# EAGLE design KGBuffer (EAGLE 9.3.1)
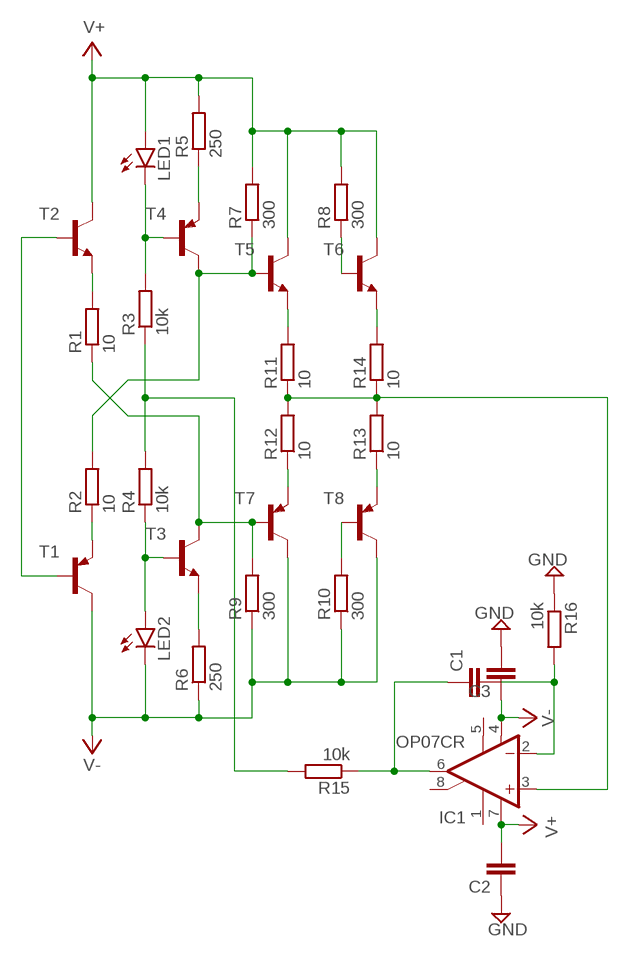
[diagram p0: schematic, sheet 1]

## Parts
C1  C-EUC0603K  [C0603K]
C2  C-EUC0805K  [C0805K]
C3  C-EUC0805K  [C0805K]
IC1  OP07CR  [SO08]
LED1  LEDSMT1206  [1206]
LED2  LEDSMT1206  [1206]
R1  10  R-EU_MELF0204W  [MINI_MELF-0204W]
R2  10  R-EU_MELF0204W  [MINI_MELF-0204W]
R3  10k  R-EU_MELF0204W  [MINI_MELF-0204W]
R4  10k  R-EU_MELF0204W  [MINI_MELF-0204W]
R5  250  R-EU_MELF0204W  [MINI_MELF-0204W]
R6  250  R-EU_MELF0204W  [MINI_MELF-0204W]
R7  300  R-EU_MELF0204W  [MINI_MELF-0204W]
R8  300  R-EU_MELF0204W  [MINI_MELF-0204W]
R9  300  R-EU_MELF0204W  [MINI_MELF-0204W]
R10  300  R-EU_MELF0204W  [MINI_MELF-0204W]
R11  10  R-EU_MELF0204W  [MINI_MELF-0204W]
R12  10  R-EU_MELF0204W  [MINI_MELF-0204W]
R13  10  R-EU_MELF0204W  [MINI_MELF-0204W]
R14  10  R-EU_MELF0204W  [MINI_MELF-0204W]
R15  10k  R-EU_MELF0204W  [MINI_MELF-0204W]
R16  10k  R-EU_MELF0204W  [MINI_MELF-0204W]
T1  BC856BLT1-PNP-SOT23-BEC  [SOT23-BEC]
T2  BC846-NPN-SOT23-BEC  [SOT23-BEC]
T3  BC846-NPN-SOT23-BEC  [SOT23-BEC]
T4  BC856BLT1-PNP-SOT23-BEC  [SOT23-BEC]
T5  BC846-NPN-SOT23-BEC  [SOT23-BEC]
T6  BC846-NPN-SOT23-BEC  [SOT23-BEC]
T7  BC856BLT1-PNP-SOT23-BEC  [SOT23-BEC]
T8  BC856BLT1-PNP-SOT23-BEC  [SOT23-BEC]

## Nets
GND: C2.1 C3.2 R16.1
N$1: T1.B T2.B
N$2: R2.1 T1.E
N$3: R1.2 T2.E
N$5: C1.1 IC1.6(OUT) R15.1
N$6: LED1.C R3.2 T4.B
N$7: R5.1 T4.E
N$8: R2.2 R7.1 T4.C T5.B
N$9: R6.2 T3.E
N$10: LED2.A R4.1 T3.B
N$11: R1.1 R9.2 T3.C T7.B
N$12: R3.1 R4.2 R15.2
N$15: R10.2 T8.B
N$16: C1.2 IC1.2(-IN) R16.2
N$20: R8.1 T6.B
N$21: R11.2 T5.E
N$23: R12.1 T7.E
N$24: R13.1 T8.E
N$26: R14.2 T6.E
N$27: IC1.3(+IN) R11.1 R12.2 R13.2 R14.1
V+: C2.2 IC1.7(V+) LED1.A R5.2 R7.2 R8.2 T2.C T5.C T6.C
V-: C3.1 IC1.4(V-) LED2.C R6.1 R9.1 R10.1 T1.C T7.C T8.C
Unconnected: IC1.1(ON1) IC1.5(OPT) IC1.8(ON2)

## Library data of the parts
C1-C3 = Vwvwbg:C-EU: CAPACITOR, European symbol
IC1 = linear:OP07*: OP AMP
LED1 LED2 = Vwvwbg:LED: LED OSRAM: - CHIPLED LG R971, LG N971, LY N971, LG Q971, LY Q971, LO R971, LY R971 LH N974, LH R974 LS Q976, LO Q976, LY Q976 LO Q996 - Hyper CHIPLED LW Q18S LB Q993, LB Q99A, LB R99A - SideLED LS A670, LO A670, LY A670, LG A670, LP A670 LB A673, LV A673, LT A673, LW A673 LH A674 LY A675 LS A676, LA A676, LO A676, LY A676, LW A676 LS A679, LY A679, LG A679 - Hyper Micro SIDELED® LS Y876, LA Y876, LO Y876, LY Y876 LT Y87S - SmartLED LW L88C, LW L88S LB L89C, LB L89S, LG L890 LS L89K, LO L89K, LY L89K LS L896, LA L896, LO L896, LY L896 - TOPLED LS T670, LO T670, LY T670, LG T670, LP T670 LSG T670, LSP T670, LSY T670, LOP T670, LYG T670 LG T671, LOG T671, LSG T671 LB T673, LV T673, LT T673, LW T673 LH T674 LS T676, LA T676, LO T676, LY T676, LB T676, LH T676, LSB T676, LW T676 LB T67C, LV T67C, LT T67C, LS T67K, LO T67K, LY T67K, LW E67C LS E67B, LA E67B, LO E67B, LY E67B, LB E67C, LV E67C, LT E67C LW T67C LS T679, LY T679, LG T679 LS T770, LO T770, LY T770, LG T770, LP T770 LB T773, LV T773, LT T773, LW T773 LH T774 LS E675, LA E675, LY E675, LS T675 LS T776, LA T776, LO T776, LY T776, LB T776 LHGB T686 LT T68C, LB T68C - Hyper Mini TOPLED® LB M676 - Mini TOPLED Santana® LG M470 LS M47K, LO M47K, LY M47K Source: http://www.osram.convergy.de LUXEON: - LUMILED® LXK2-PW12-R00, LXK2-PW12-S00, LXK2-PW14-U00, LXK2-PW14-V00 LXK2-PM12-R00, LXK2-PM12-S00, LXK2-PM14-U00 LXK2-PE12-Q00, LXK2-PE12-R00, LXK2-PE12-S00, LXK2-PE14-T00, LXK2-PE14-U00 LXK2-PB12-K00, LXK2-PB12-L00, LXK2-PB12-M00, LXK2-PB14-N00, LXK2-PB14-P00, LXK2-PB14-Q00 LXK2-PR12-L00, LXK2-PR12-M00, LXK2-PR14-Q00, LXK2-PR14-R00 LXK2-PD12-Q00, LXK2-PD12-R00, LXK2-PD12-S00 LXK2-PH12-R00, LXK2-PH12-S00 LXK2-PL12-P00, LXK2-PL12-Q00, LXK2-PL12-R00 Source: www.luxeon.com KINGBRIGHT: KA-3528ASYC Source: www.kingbright.com
R1-R16 = Vwvwbg:R-EU_: RESISTOR, European symbol
T1 T4 T7 T8 = transistor-neu-to92:*-PNP-: PNP Transistror
T2 T3 T5 T6 = transistor-neu-to92:*-NPN-: NPN Transistror

## Board
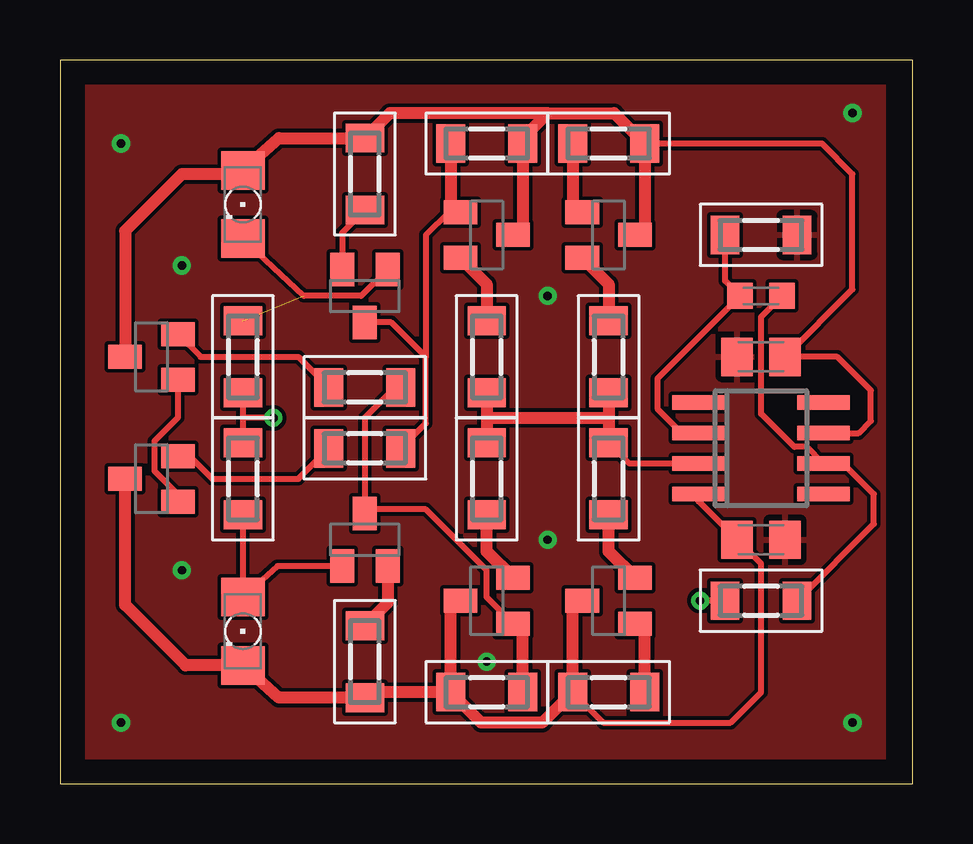
[diagram p1: board, top side]
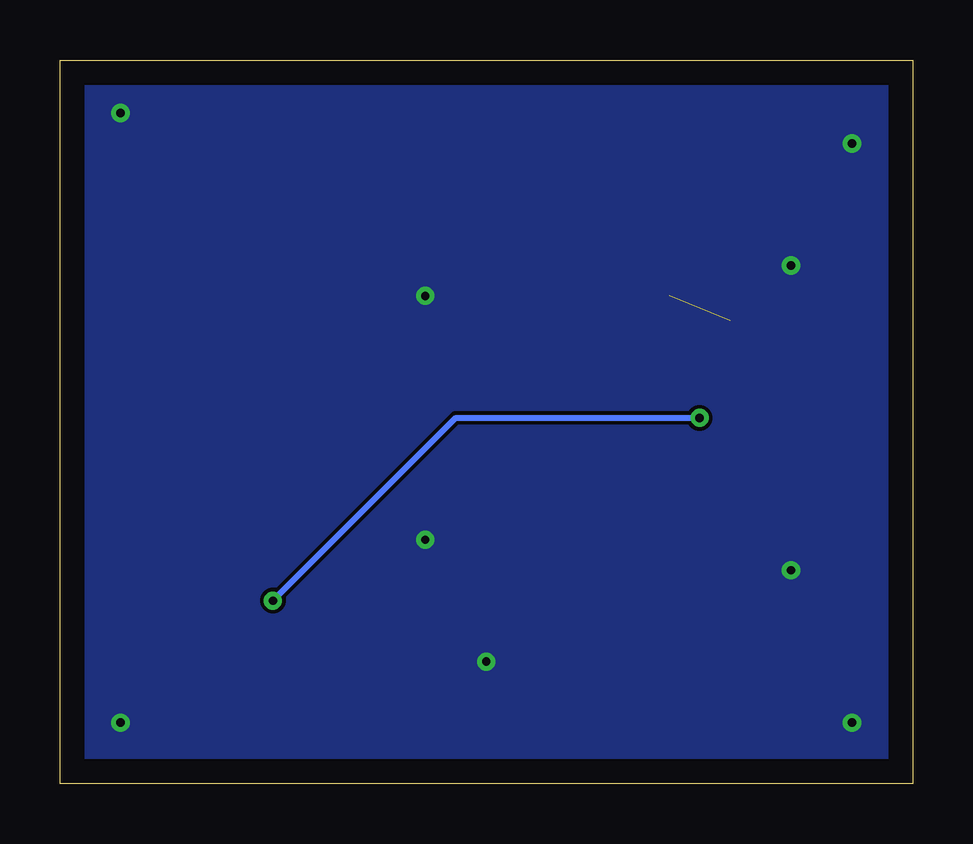
[diagram p2: board, bottom side, seen from below]

Size 35.54 x 30.15 mm. Coordinates in mm from the lower left corner, seen from the top.
Outline: 0,0 35.54,0 35.54,30.15 0,30.15 0,0
Copper layers (1*16): Top 0.035mm / dielectric 1.5mm / Bottom 0.035mm
Design rules "default": minimum track width 6mil, minimum drill 0.35mm, track to track 6mil, track to pad 6mil, pad to pad 6mil, via to via 6mil, smd to smd 6mil, copper to edge 40mil, drill to drill 6mil, minimum pad ring 10mil, minimum via ring 8mil, stop-mask expansion 4mil, vias tented up to drill 0mil, thermal gap 10mil

### Footprints (pad centres in the part's own frame; a part is rotated, then mirrored left to right if it is on the bottom)
C0603K = smd 1.05 x 1.08: 1 -0.875,0; 2 0.875,0
C0805K = smd 1.3 x 1.6: 1 -1,0; 2 1,0
SO08 = smd 0.6 x 2.2: 1 -1.905,-2.6; 2 -0.635,-2.6; 3 0.635,-2.6; 4 1.905,-2.6; 5 1.905,2.6; 6 0.635,2.6; 7 -0.635,2.6; 8 -1.905,2.6
1206 = smd 1.6 x 1.803: A -1.422,0; C 1.422,0
MINI_MELF-0204W = smd 1.2 x 1.6: 1 -1.5,0; 2 1.5,0
SOT23-BEC = smd 1 x 1.4: B -0.95,-1.1; C 0,1.1; E 0.95,-1.1

### Placement (x,y rotation side)
C1  29.21,20.32 180 top
C2  29.21,17.78 0 top
C3  29.21,10.16 0 top
IC1  29.21,13.97 270 top
LED1  7.62,24.13 270 top
LED2  7.62,6.35 270 top
R1  12.7,16.51 180 top
R2  12.7,13.97 0 top
R3  7.62,17.78 90 top
R4  7.62,12.7 90 top
R5  12.7,25.4 90 top
R6  12.7,5.08 90 top
R7  17.78,26.67 0 top
R8  22.86,26.67 0 top
R9  17.78,3.81 0 top
R10  22.86,3.81 0 top
R11  17.78,17.78 90 top
R12  17.78,12.7 90 top
R13  22.86,12.7 90 top
R14  22.86,17.78 90 top
R15  29.21,7.62 180 top
R16  29.21,22.86 180 top
T1  3.81,12.7 90 top
T2  3.81,17.78 90 top
T3  12.7,10.16 0 top
T4  12.7,20.32 180 top
T5  17.78,22.86 270 top
T6  22.86,22.86 270 top
T7  17.78,7.62 90 top
T8  22.86,7.62 90 top

### Tracks (layer width: path | path; a pad name or v marks a point on that pad's centre or on a via)
GND  (via drill 0.35)
  other vias: 2.54,26.67 5.08,21.59 5.08,8.89 17.78,5.08 33.02,2.54 33.02,27.94 2.54,2.54 20.32,10.16 20.32,20.32
  pour Top: 1.27,29.21 34.29,29.21 34.29,0 0,0 0,29.21
  pour Bottom: 0,29.21 35.56,29.21 35.56,0 0,0
N$1
  Top 0.254: T2.B 4.91,15.24 3.93,14.27 3.93,13.03 4.91,12.05 T1.B
N$2
  Top 0.254: T1.E 5.4,13.65 6.35,12.7 9.93,12.7 R2.1
N$3
  Top 0.254: T2.E 5.86,17.78 9.93,17.78 R1.2
N$5
  Top 0.254: R15.1 33.91,10.82 33.91,12.06 32.64,13.34 IC1.6 31.12,14.03 30.59,14.03 29.21,15.41 29.21,19.45 C1.1
N$6  (1 unrouted)
  Top 0.254: T4.B 12.55,20.32 10.16,20.32 LED1.C
N$7
  Top 0.254: R5.1 11.75,22.95 T4.E
N$8
  Top 0.254: R2.2 15.24,15.01 15.24,17.78 | T4.C 13.8,19.22 15.24,17.78 | T5.B 16.19,23.81 15.24,22.86 15.24,17.78
  Top 0.508: R7.1 16.28,24.21 T5.B
N$9
  Top 0.508: T3.E 13.65,7.53 R6.2
N$10
  Top 0.254: T3.B 9.06,9.06 LED2.A R4.1
N$11
  Top 0.254: R1.1 13.97,16.51 12.7,15.24 12.7,11.43 | 12.7,11.43 T3.C | T7.B 17.78,7.77 17.78,8.89 15.24,11.43 12.7,11.43
  Top 0.508: R9.2 19.28,6.27 T7.B
N$12  (via drill 0.35)
  Top 0.254: R3.1 7.62,15.24 | 7.62,15.24 R4.2 | R15.2 v26.67,7.62 | v8.89,15.24 7.62,15.24
  Bottom 0.254: v26.67,7.62 19.05,15.24 v8.89,15.24
N$15
  Top 0.508: R10.2 24.36,6.27 T8.B
N$16
  Top 0.254: IC1.2 25.91,14.61 24.89,15.62 24.89,16.88 C1.2 27.71,20.95 R16.2
N$20
  Top 0.508: R8.1 21.36,24.21 T6.B
N$21
  Top 0.508: T5.E 17.78,20.81 R11.2
N$23
  Top 0.508: T7.E 17.78,9.67 R12.1
N$24
  Top 0.508: T8.E 22.86,9.67 R13.1
N$26
  Top 0.508: T6.E 22.86,20.81 R14.2
N$27
  Top 0.254: IC1.3 23.73,13.34 R13.2
  Top 0.508: R11.1 17.78,15.24 | 17.78,15.24 R12.2 | R14.1 22.86,15.24 | 22.86,15.24 R13.2 | 17.78,15.24 22.86,15.24
V+
  Top 0.254: IC1.7 33.27,14.61 33.78,15.11 33.78,16.38 32.38,17.78 C2.2 33.02,20.59 33.02,25.4 31.75,26.67 R8.2
  Top 0.508: 20.32,27.94 23.09,27.94 R8.2 24.36,23.26 T6.C | 20.32,27.94 19.28,26.9 R7.2 19.28,23.26 T5.C | 20.32,27.94 13.74,27.94 R5.2 9.12,26.9 LED1.A 7.47,25.4 5.08,25.4 2.71,23.03 T2.C
V-
  Top 0.254: IC1.4 26.61,11.76 C3.1 29.21,9.16 29.21,3.81 27.94,2.54 22.63,2.54 R10.1
  Top 0.508: R9.1 12.93,3.81 R6.1 9.12,3.58 LED2.C 5.23,4.93 2.71,7.45 T1.C | R9.1 17.55,2.54 20.09,2.54 R10.1 21.36,7.22 T8.C | R9.1 16.28,7.22 T7.C